# EAGLE design LM317_protected (EAGLE 7.1.0)
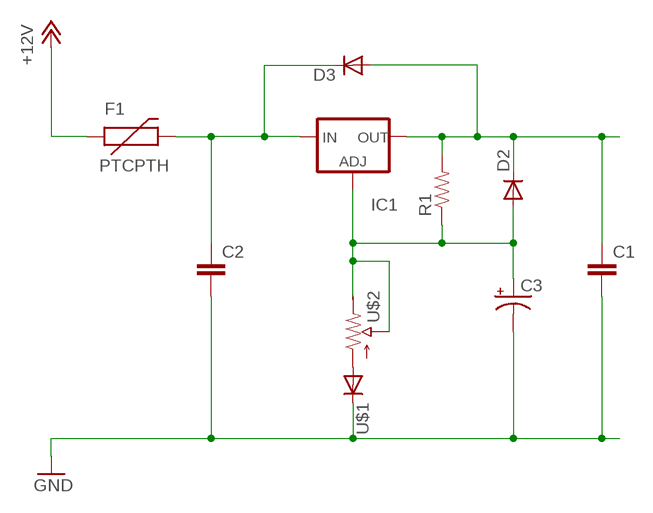
[diagram p0: schematic, sheet 1]

## Parts
C1  CAPKIT  [CAP-PTH-SMALL-KIT]
C2  CAPKIT  [CAP-PTH-SMALL-KIT]
C3  CAP_POLPTH2  [CPOL-RADIAL-10UF-25V]
D2  DIODEPTH  [DIODE-1N4001]
D3  DIODEPTH  [DIODE-1N4001]
F1  PTCPTH  [PTC]
IC1  LM337TS  [337TS]
R1  RESISTORAXIAL-0.3  [AXIAL-0.3]
U$1  DIODE1N4148  [DIODE-1N4148]
U$2  POT100K_3362U  [3362U]

## Nets
+12V: F1.P$1
AGND: C1.2 C2.2 C3.2(-) U$1.C ; supply symbol labelled GND
N$1: C3.1(+) D2.A IC1.1(ADJ) R1.P$1 U$2.P$1(E) U$2.P$2(S)
N$2: C1.1 D2.C D3.A IC1.3(OUT) R1.P$2
N$3: C2.1 D3.C F1.P$2 IC1.2(IN)
N$6: U$1.A U$2.P$3(A)

## Library data of the parts
C1 C2 = SparkFun:CAP: Capacitor Standard 0603 ceramic capacitor, and 0.1" leaded capacitor.
C3 = SparkFun:CAP_POL: Capacitor Polarized These are standard SMD and PTH capacitors. Normally 10uF, 47uF, and 100uF in electrolytic and tantalum varieties. Always verify the external diameter of the through hole cap, it varies with capacity, voltage, and manufacturer. The EIA devices should be standard.
D2 D3 U$1 = SparkFun:DIODE: Diode These are standard reverse protection diodes and small signal diodes. SMA package can handle up to about 1A. SOD-323 can handle about 200mA. What the SOD-323 package when ordering, there are some mfgs out there that are 5-pin packages.
F1 = SparkFun:PTC: Resettable Fuse PTC Resettable Fuse. Spark Fun Electronics SKU : COM-08357
IC1 = v-reg:LM337TS: VOLTAGE REGULATOR
R1 = My Library:RESISTOR: Resistor Basic schematic elements and footprints for 0603, 1206, and PTH resistors.
U$2 = My Library:POT

## Board
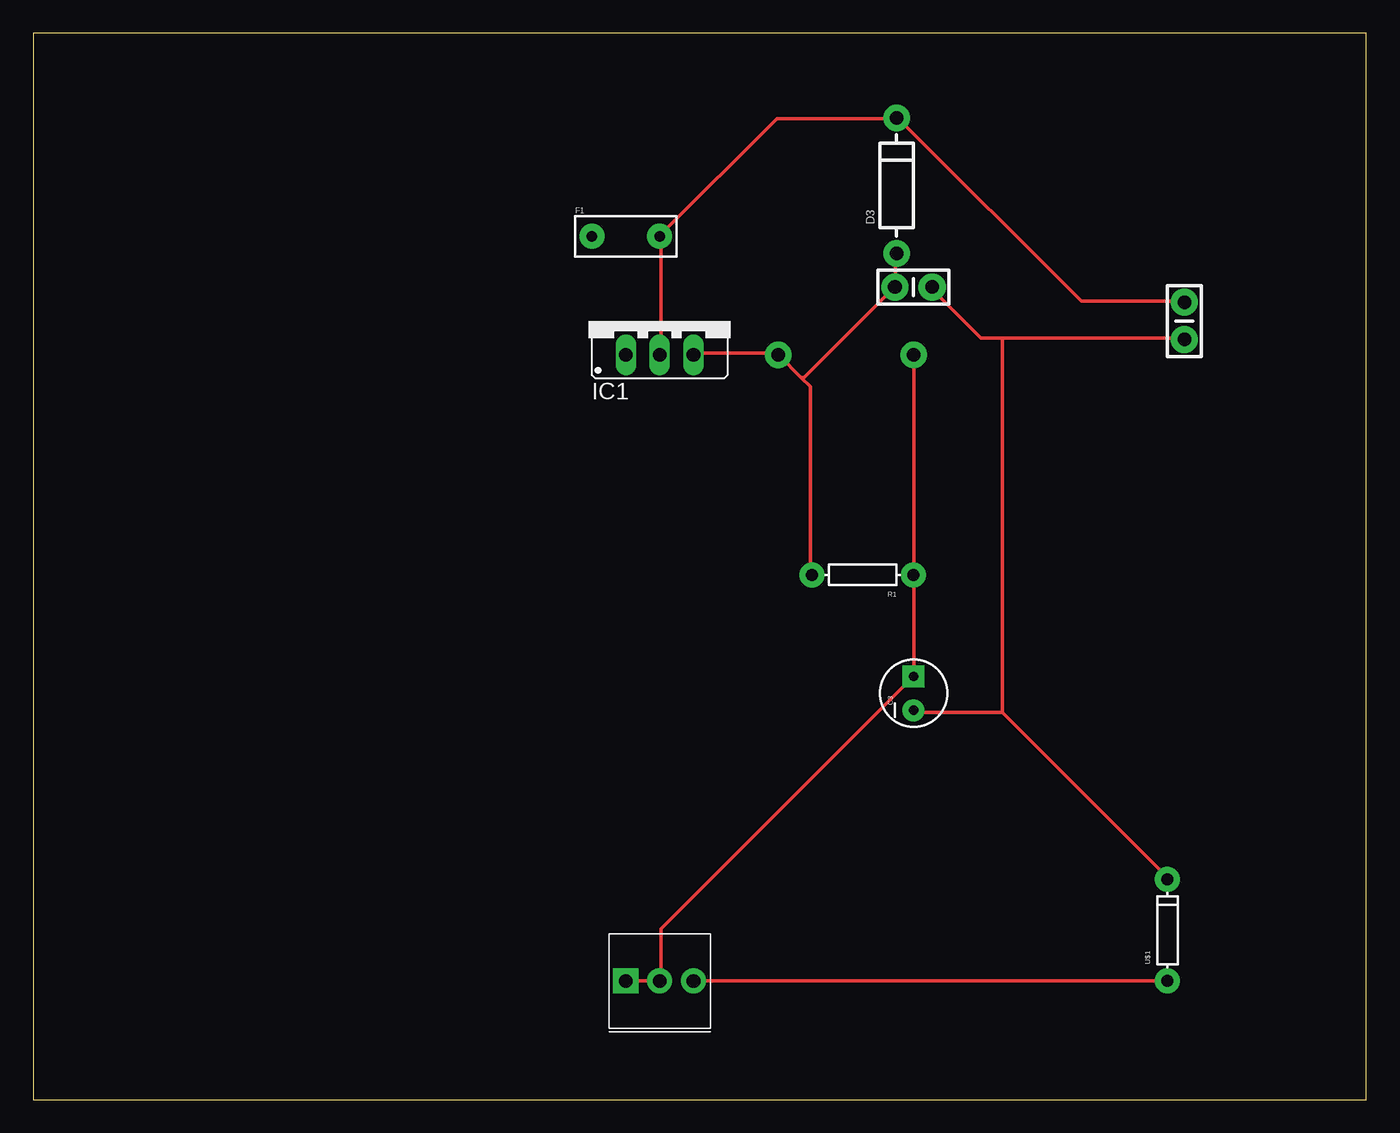
[diagram p1: board, top side]
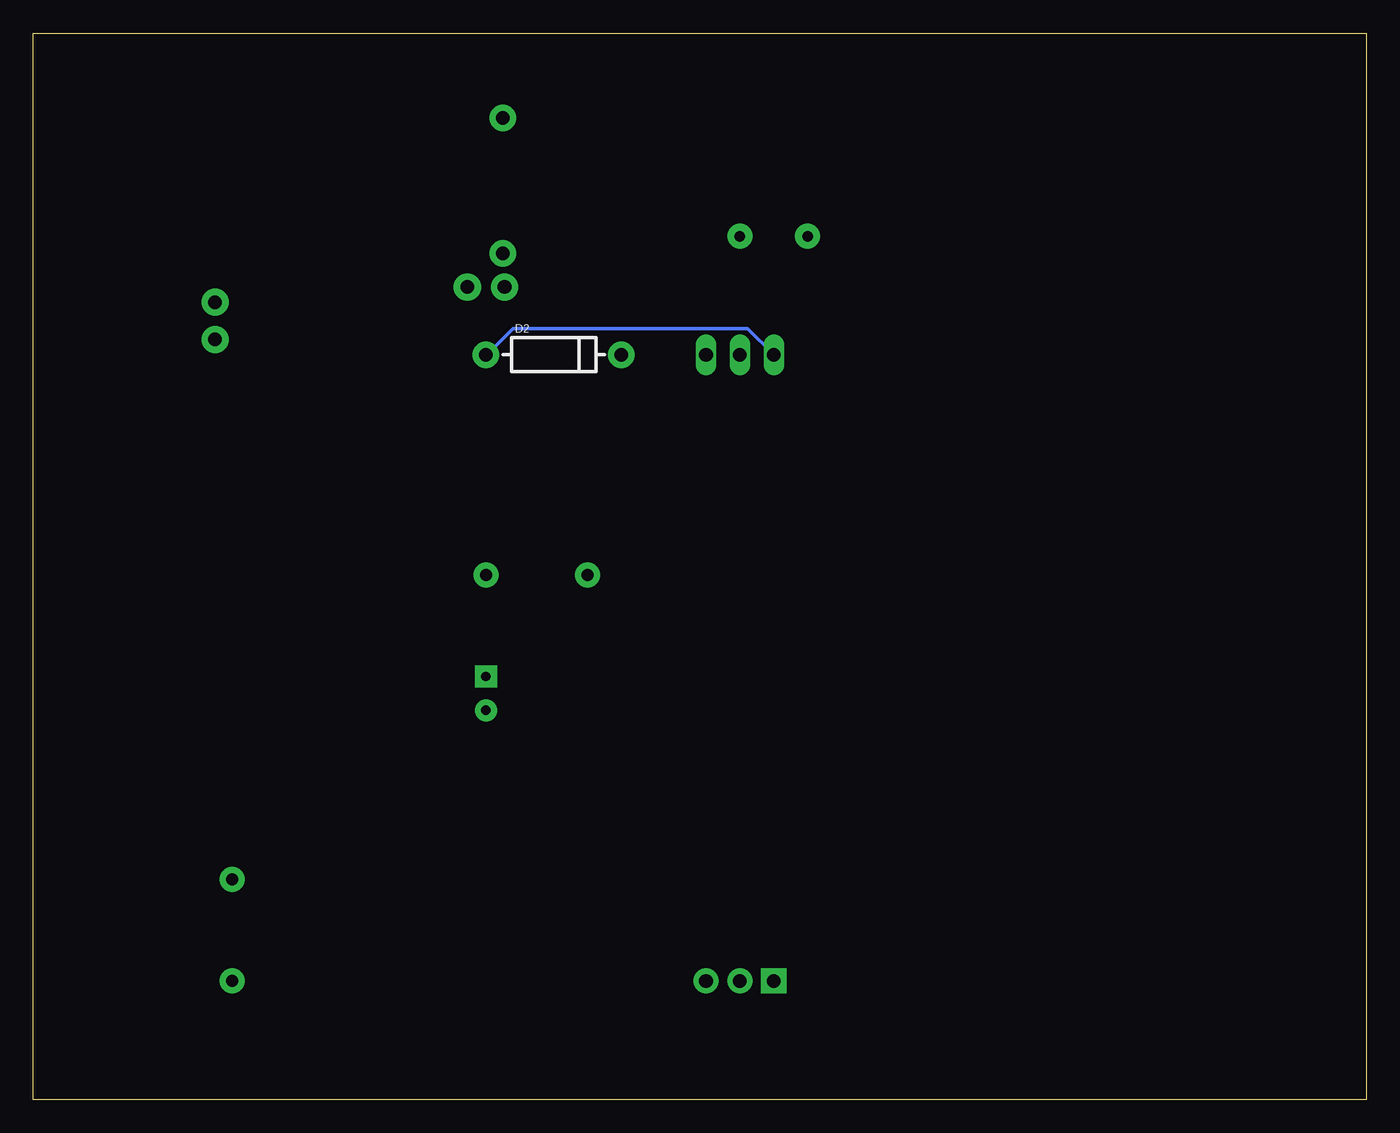
[diagram p2: board, bottom side, seen from below]

Size 100 x 80 mm. Coordinates in mm from the lower left corner, seen from the top.
Outline: 0,0 100,0 100,80 0,80 0,0
Copper layers (1*16): Top 0.035mm / dielectric 1.5mm / Bottom 0.035mm
Design rules "default": minimum track width 10mil, minimum drill 24mil, track to track 8mil, track to pad 8mil, pad to pad 8mil, via to via 8mil, smd to smd 8mil, copper to edge 40mil, drill to drill 8mil, minimum pad ring 10mil, minimum via ring 8mil, stop-mask expansion 4mil, vias tented up to drill 0mil, thermal gap 10mil

### Footprints (pad centres in the part's own frame; a part is rotated, then mirrored left to right if it is on the bottom)
CAP-PTH-SMALL-KIT = drill 1.016 pad 2.032: 1 -1.397,0; 2 1.397,0
CPOL-RADIAL-10UF-25V = drill 0.7 pad 1.651 square: 1 1.27,0 | drill 0.7 pad 1.651: 2 -1.27,0
DIODE-1N4001 = drill 1 pad 1.981: A -5.08,0; C 5.08,0
PTC = drill 0.8 pad 1.88: P$1 -2.54,0; P$2 2.54,0
337TS = drill 1.016 long: 1 -2.54,-2.54; 2 0,-2.54; 3 2.54,-2.54
AXIAL-0.3 = drill 0.9 pad 1.88: P$1 -3.81,0; P$2 3.81,0
DIODE-1N4148 = drill 0.9 pad 1.88: A -3.81,0; C 3.81,0
3362U = drill 1.016 pad 1.88 square: P$1 0,2.54 | drill 1.016 pad 1.88: P$2 2.54,2.54; P$3 5.08,2.54

### Placement (x,y rotation side)
C1  66.04,60.96 0 top
C2  86.36,58.42 270 top
C3  66.04,30.48 90 top
D2  60.96,55.88 0 bottom
D3  64.77,68.58 90 top
F1  44.45,64.77 0 top
IC1  46.99,58.42 0 top
R1  62.23,39.37 180 top
U$1  85.09,12.7 90 top
U$2  44.45,6.35 0 top

### Tracks (layer width: path | path; a pad name or v marks a point on that pad's centre or on a via)
AGND
  Top 0.254: 72.69,57.15 71.09,57.15 67.44,60.81 C1.2 | 72.69,57.15 86.18,57.15 C2.2 | 72.69,29.03 66.06,29.03 C3.2 | 72.69,29.03 85.04,16.69 U$1.C | 72.69,29.03 72.69,57.15
N$1
  Top 0.254: U$2.P$1 44.58,8.91 46.86,8.91 U$2.P$2 47.09,8.91 47.09,12.8 C3.1 66.06,31.77 66.06,39.32 R1.P$1 66.06,39.55 66.06,55.78 D2.A
  Bottom 0.254: IC1.1 46.41,57.84 64.01,57.84 65.84,56.01 D2.A
N$2
  Top 0.254: D3.A 64.69,63.32 64.69,61.04 C1.1 64.47,60.81 57.84,54.18 57.61,54.18 | IC1.3 49.61,56.01 55.78,56.01 D2.C 56.01,55.78 57.61,54.18 | 57.61,54.18 58.29,53.49 58.29,39.55 R1.P$2
N$3
  Top 0.254: IC1.2 47.09,56.01 47.09,64.69 F1.P$2 47.09,64.92 55.78,73.61 64.69,73.61 D3.C 64.92,73.61 78.64,59.89 86.18,59.89 C2.1
N$6
  Top 0.254: U$2.P$3 49.61,8.91 85.04,8.91 U$1.A